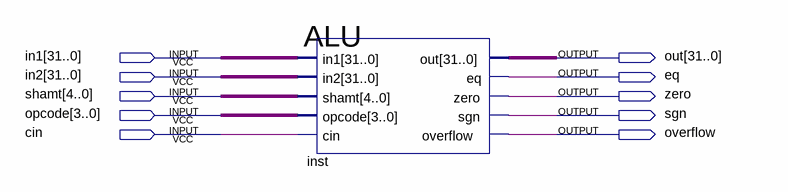
[diagram p0: schematic sheet]
// Quartus schematic ALU_TEST.bdf as structural Verilog: 1 symbols, 10 pins
module ALU_TEST (
  input  [31:0] in1,
  input  [31:0] in2,
  input  [4:0] shamt,
  input  [3:0] opcode,
  input  cin,
  output [31:0] out,
  output eq,
  output zero,
  output sgn,
  output overflow
);

  ALU inst (
    .in1(in1), .in2(in2), .shamt(shamt), .opcode(opcode), .cin(cin), .out(out), .eq(eq), .zero(zero),
    .sgn(sgn), .overflow(overflow));
endmodule
